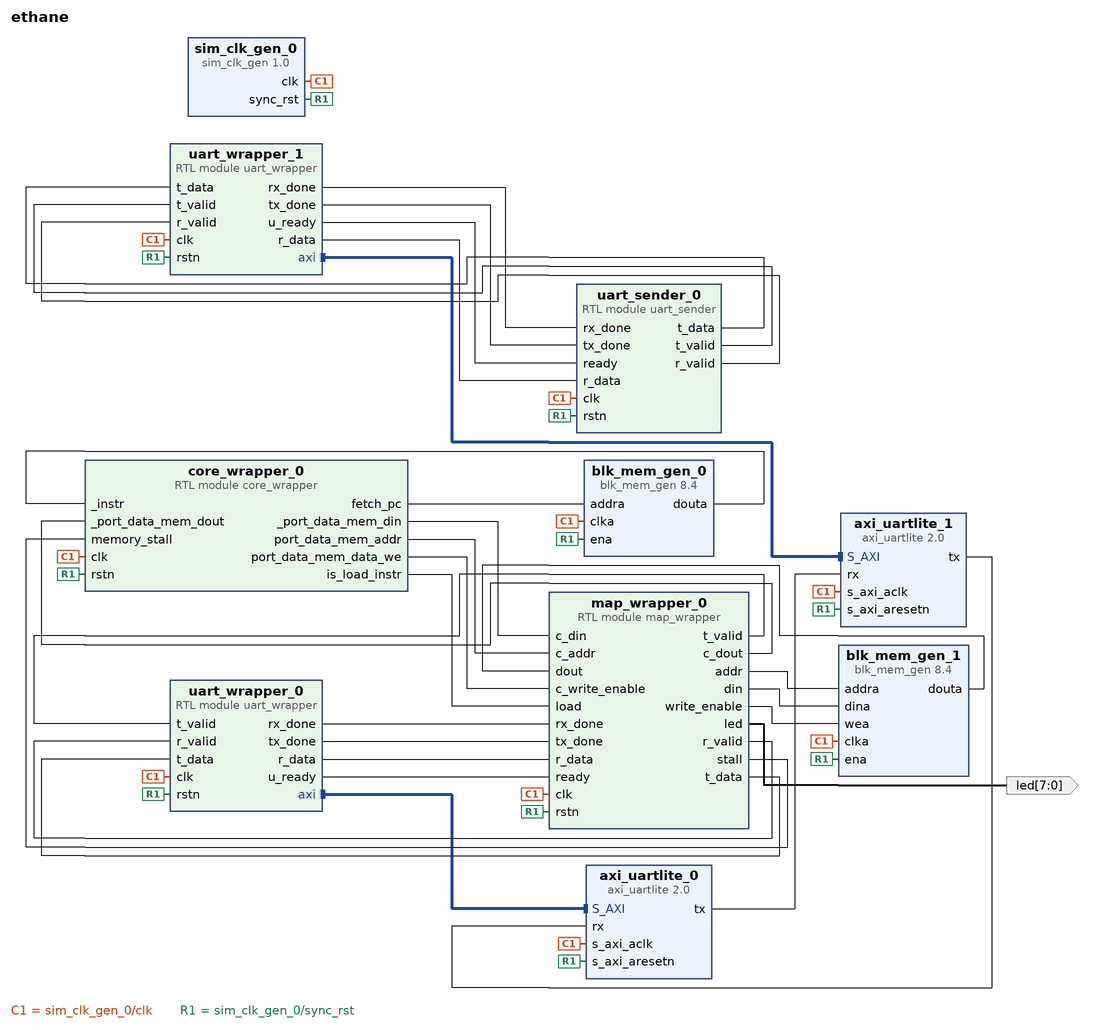
[diagram p0: block diagram of the top level]
# Vivado block design ethane, xcku040-ffva1156-2-e, Vivado 2017.4
create_bd_design ethane

create_bd_port -dir O -from 7 -to 0 -type data led

create_bd_cell -type ip -vlnv xilinx.com:ip:sim_clk_gen:1.0 sim_clk_gen_0
set_property -dict {CONFIG.INITIAL_RESET_CLOCK_CYCLES 5} [get_bd_cells sim_clk_gen_0]
create_bd_cell -type ip -vlnv xilinx.com:ip:blk_mem_gen:8.4 blk_mem_gen_0
set_property -dict [list \
  CONFIG.Memory_Type Single_Port_ROM \
  CONFIG.Enable_32bit_Address true \
  CONFIG.Write_Depth_A 262144 \
  CONFIG.Register_PortA_Output_of_Memory_Primitives false \
  CONFIG.Load_Init_File true \
  CONFIG.Coe_File {../../../../../../../../../ダウンロード/g.coe} \
  CONFIG.Use_RSTA_Pin false \
  CONFIG.Port_A_Write_Rate 0 \
  CONFIG.use_bram_block Stand_Alone \
] [get_bd_cells blk_mem_gen_0]
create_bd_cell -type ip -vlnv xilinx.com:ip:axi_uartlite:2.0 axi_uartlite_0
set_property -dict {CONFIG.C_BAUDRATE 230400} [get_bd_cells axi_uartlite_0]
create_bd_cell -type ip -vlnv xilinx.com:ip:blk_mem_gen:8.4 blk_mem_gen_1
set_property -dict [list \
  CONFIG.Enable_32bit_Address true \
  CONFIG.Write_Depth_A 262144 \
  CONFIG.Register_PortA_Output_of_Memory_Primitives false \
  CONFIG.Load_Init_File true \
  CONFIG.Coe_File {../../../../../../../../../ダウンロード/g.coe} \
  CONFIG.Use_RSTA_Pin false \
  CONFIG.use_bram_block Stand_Alone \
] [get_bd_cells blk_mem_gen_1]
create_bd_cell -type module -reference uart_wrapper uart_wrapper_0
create_bd_cell -type ip -vlnv xilinx.com:ip:axi_uartlite:2.0 axi_uartlite_1
set_property -dict {CONFIG.C_BAUDRATE 230400} [get_bd_cells axi_uartlite_1]
create_bd_cell -type module -reference uart_wrapper uart_wrapper_1
create_bd_cell -type module -reference uart_sender uart_sender_0
create_bd_cell -type module -reference map_wrapper map_wrapper_0
create_bd_cell -type module -reference core_wrapper core_wrapper_0

# ---- connections ----

connect_bd_intf_net [get_bd_intf_pins uart_wrapper_0/axi] [get_bd_intf_pins axi_uartlite_0/S_AXI]
connect_bd_intf_net -intf_net uart_wrapper_0_axi1 [get_bd_intf_pins uart_wrapper_1/axi] [get_bd_intf_pins axi_uartlite_1/S_AXI]
connect_bd_net [get_bd_pins sim_clk_gen_0/clk] \
  [get_bd_pins blk_mem_gen_0/clka] [get_bd_pins axi_uartlite_0/s_axi_aclk] [get_bd_pins blk_mem_gen_1/clka] \
  [get_bd_pins uart_wrapper_0/clk] [get_bd_pins axi_uartlite_1/s_axi_aclk] [get_bd_pins uart_wrapper_1/clk] \
  [get_bd_pins uart_sender_0/clk] [get_bd_pins map_wrapper_0/clk] [get_bd_pins core_wrapper_0/clk]
connect_bd_net [get_bd_pins sim_clk_gen_0/sync_rst] \
  [get_bd_pins axi_uartlite_0/s_axi_aresetn] [get_bd_pins blk_mem_gen_0/ena] [get_bd_pins blk_mem_gen_1/ena] \
  [get_bd_pins uart_wrapper_0/rstn] [get_bd_pins axi_uartlite_1/s_axi_aresetn] [get_bd_pins uart_wrapper_1/rstn] \
  [get_bd_pins uart_sender_0/rstn] [get_bd_pins map_wrapper_0/rstn] [get_bd_pins core_wrapper_0/rstn]
connect_bd_net [get_bd_pins core_wrapper_0/fetch_pc] [get_bd_pins blk_mem_gen_0/addra]
connect_bd_net [get_bd_pins blk_mem_gen_0/douta] [get_bd_pins core_wrapper_0/_instr]
connect_bd_net [get_bd_pins map_wrapper_0/t_valid] [get_bd_pins uart_wrapper_0/t_valid]
connect_bd_net [get_bd_pins map_wrapper_0/r_valid] [get_bd_pins uart_wrapper_0/r_valid]
connect_bd_net [get_bd_pins uart_wrapper_0/rx_done] [get_bd_pins map_wrapper_0/rx_done]
connect_bd_net [get_bd_pins uart_wrapper_0/tx_done] [get_bd_pins map_wrapper_0/tx_done]
connect_bd_net [get_bd_pins uart_wrapper_0/r_data] [get_bd_pins map_wrapper_0/r_data]
connect_bd_net [get_bd_pins uart_wrapper_0/u_ready] [get_bd_pins map_wrapper_0/ready]
connect_bd_net [get_bd_pins map_wrapper_0/t_data] [get_bd_pins uart_wrapper_0/t_data]
connect_bd_net [get_bd_pins map_wrapper_0/led] [get_bd_ports led]
connect_bd_net [get_bd_pins map_wrapper_0/addr] [get_bd_pins blk_mem_gen_1/addra]
connect_bd_net [get_bd_pins map_wrapper_0/din] [get_bd_pins blk_mem_gen_1/dina]
connect_bd_net [get_bd_pins blk_mem_gen_1/douta] [get_bd_pins map_wrapper_0/dout]
connect_bd_net [get_bd_pins map_wrapper_0/write_enable] [get_bd_pins blk_mem_gen_1/wea]
connect_bd_net [get_bd_pins map_wrapper_0/c_dout] [get_bd_pins core_wrapper_0/_port_data_mem_dout]
connect_bd_net -net core_wrapper_0_port_data_mem_din [get_bd_pins core_wrapper_0/_port_data_mem_din] [get_bd_pins map_wrapper_0/c_din]
connect_bd_net [get_bd_pins core_wrapper_0/port_data_mem_addr] [get_bd_pins map_wrapper_0/c_addr]
connect_bd_net [get_bd_pins core_wrapper_0/port_data_mem_data_we] [get_bd_pins map_wrapper_0/c_write_enable]
connect_bd_net [get_bd_pins map_wrapper_0/stall] [get_bd_pins core_wrapper_0/memory_stall]
connect_bd_net [get_bd_pins core_wrapper_0/is_load_instr] [get_bd_pins map_wrapper_0/load]
connect_bd_net [get_bd_pins axi_uartlite_0/tx] [get_bd_pins axi_uartlite_1/rx]
connect_bd_net [get_bd_pins axi_uartlite_1/tx] [get_bd_pins axi_uartlite_0/rx]
connect_bd_net [get_bd_pins uart_sender_0/t_data] [get_bd_pins uart_wrapper_1/t_data]
connect_bd_net [get_bd_pins uart_sender_0/t_valid] [get_bd_pins uart_wrapper_1/t_valid]
connect_bd_net [get_bd_pins uart_sender_0/r_valid] [get_bd_pins uart_wrapper_1/r_valid]
connect_bd_net [get_bd_pins uart_wrapper_1/rx_done] [get_bd_pins uart_sender_0/rx_done]
connect_bd_net [get_bd_pins uart_wrapper_1/tx_done] [get_bd_pins uart_sender_0/tx_done]
connect_bd_net [get_bd_pins uart_wrapper_1/u_ready] [get_bd_pins uart_sender_0/ready]
connect_bd_net [get_bd_pins uart_wrapper_1/r_data] [get_bd_pins uart_sender_0/r_data]

validate_bd_design
save_bd_design
